# EAGLE schematic cryotest-kintex7 (EAGLE 7.4.0)

## Sheet 1 of 15: JTAG
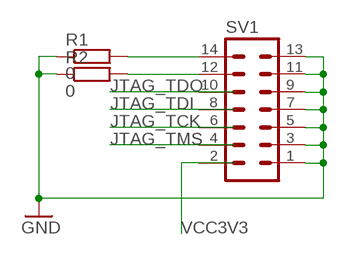
[diagram p0: schematic, sheet 1]

### Parts
R1  0  R-EU_R0805  [R0805]
R2  0  R-EU_R0805  [R0805]
SV1  MA07-2  [MA07-2]

### Nets
12_SV1: R2.2 SV1.12
14_SV1: R1.2 SV1.14
GND: R1.1 R2.1 SV1.1 SV1.3 SV1.5 SV1.7 SV1.9 SV1.11 SV1.13 ; also sheet 2,7,9,10,11,12,13,14,15
Unconnected: SV1.2 SV1.4 SV1.6 SV1.8 SV1.10

## Sheet 2 of 15: FPGA Bank 0
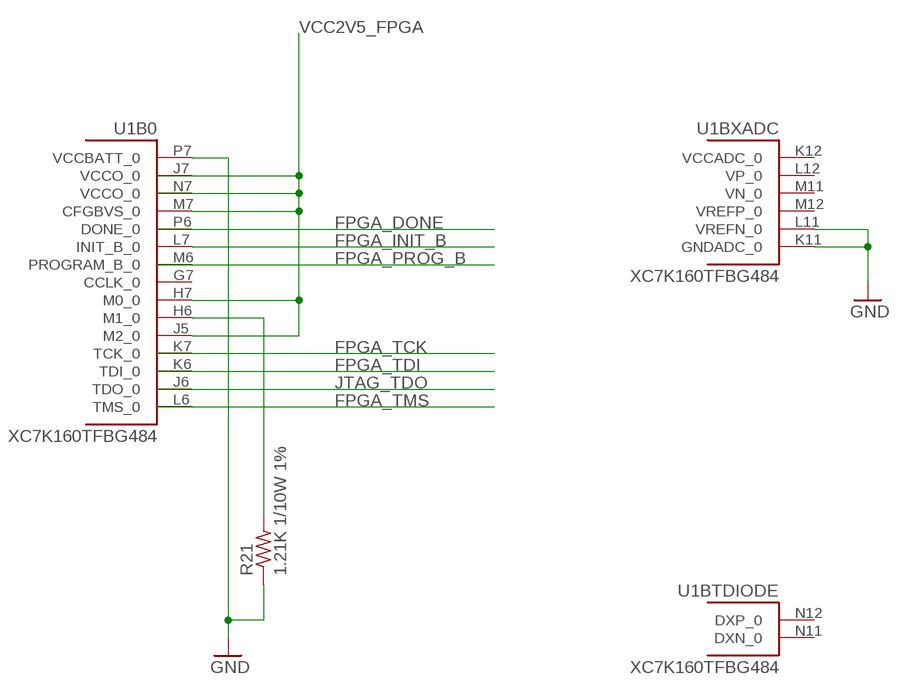
[diagram p1: schematic, sheet 2]

### Parts
R21  1.21K 1/10W 1%  R-US_R0402  [R0402]
U1  XC7K160TFBG484  [FF484]

### Nets
FPGA_INIT_B: U1.L7(B0:INIT_B_0) ; also sheet 7
FPGA_M1: R21.2 U1.H6(B0:M1_0)
GND: R21.1 U1.K11(BXADC:GNDADC_0) U1.L11(BXADC:VREFN_0) U1.P7(B0:VCCBATT_0) ; also sheet 1,7,9,10,11,12,13,14,15
VCC2V5_FPGA: U1.H7(B0:M0_0) U1.J5(B0:M2_0) U1.M7(B0:CFGBVS_0) ; also sheet 3,4,7,10,13,14
Unconnected: U1.G7(B0:CCLK_0) U1.J6(B0:TDO_0) U1.J7(B0:VCCO_0) U1.K6(B0:TDI_0) U1.K7(B0:TCK_0) U1.K12(BXADC:VCCADC_0) U1.L6(B0:TMS_0) U1.L12(BXADC:VP_0) U1.M6(B0:PROGRAM_B_0) U1.M11(BXADC:VN_0) U1.M12(BXADC:VREFP_0) U1.N7(B0:VCCO_0) U1.N11(BTDIODE:DXN_0) U1.N12(BTDIODE:DXP_0) U1.P6(B0:DONE_0)

## Sheet 3 of 15: FPGA Banks 13, 14
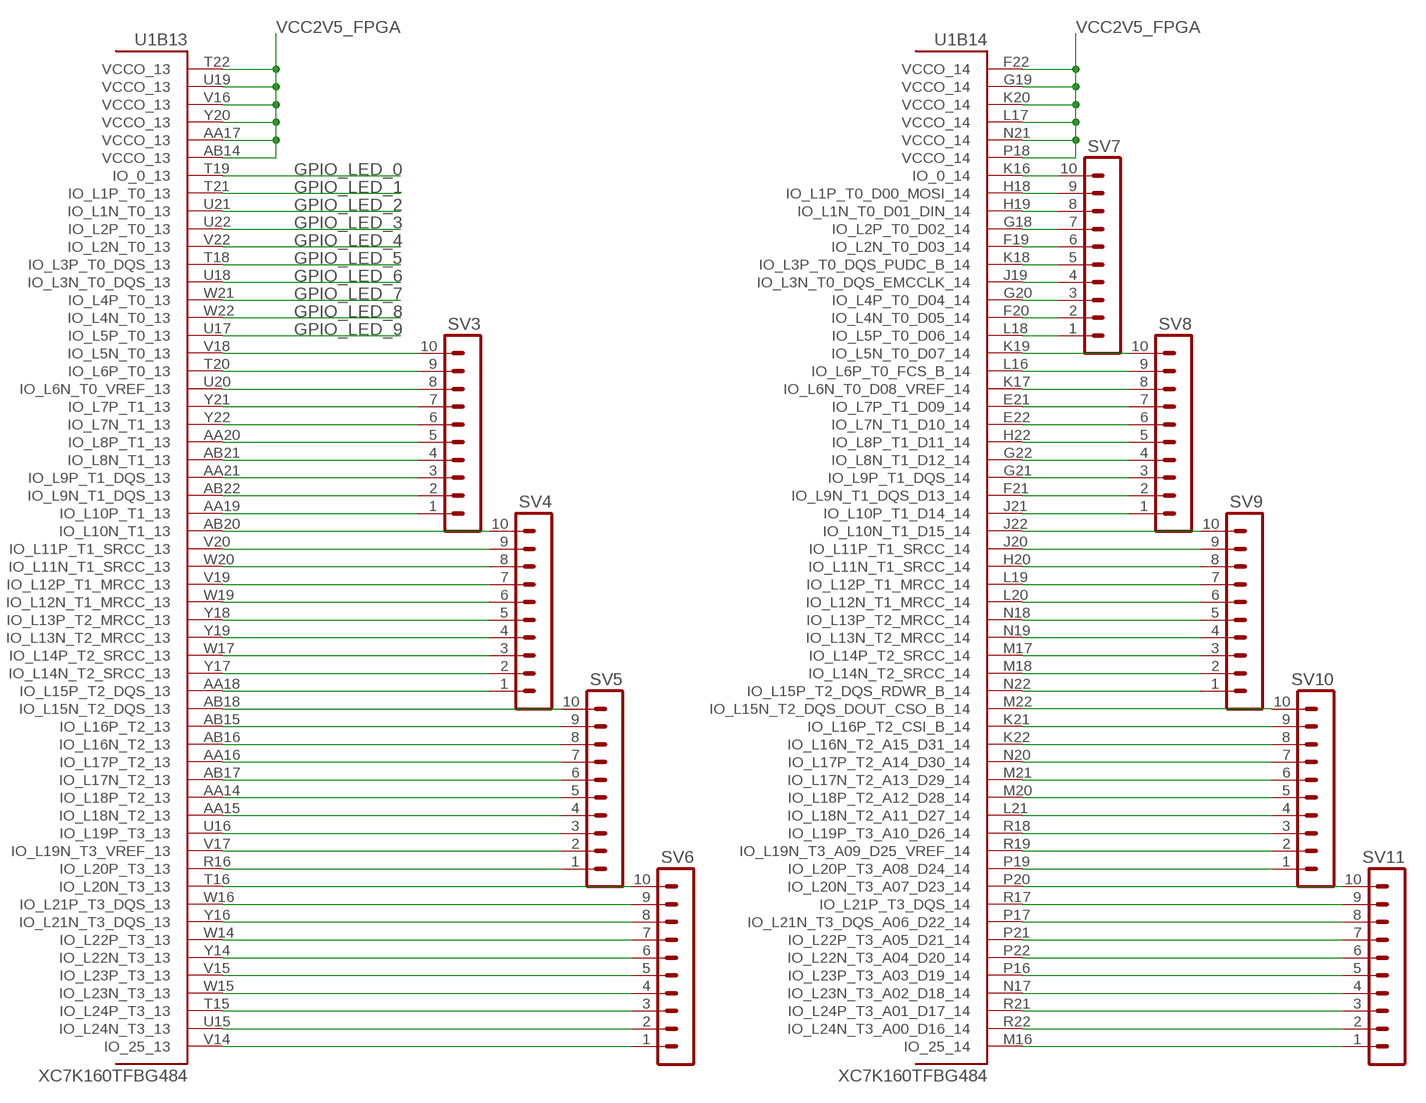
[diagram p2: schematic, sheet 3]

### Parts
SV3  MA10-1  [MA10-1]
SV4  MA10-1  [MA10-1]
SV5  MA10-1  [MA10-1]
SV6  MA10-1  [MA10-1]
SV7  MA10-1  [MA10-1]
SV8  MA10-1  [MA10-1]
SV9  MA10-1  [MA10-1]
SV10  MA10-1  [MA10-1]
SV11  MA10-1  [MA10-1]

### Nets
GPIO_LED_0: U1.T19(B13:IO_0_13) ; also sheet 7
GPIO_LED_1: U1.T21(B13:IO_L1P_T0_13) ; also sheet 7
GPIO_LED_2: U1.U21(B13:IO_L1N_T0_13) ; also sheet 7
GPIO_LED_3: U1.U22(B13:IO_L2P_T0_13) ; also sheet 7
GPIO_LED_4: U1.V22(B13:IO_L2N_T0_13) ; also sheet 7
GPIO_LED_5: U1.T18(B13:IO_L3P_T0_DQS_13) ; also sheet 7
GPIO_LED_6: U1.U18(B13:IO_L3N_T0_DQS_13) ; also sheet 7
GPIO_LED_7: U1.W21(B13:IO_L4P_T0_13) ; also sheet 7
GPIO_LED_8: U1.W22(B13:IO_L4N_T0_13) ; also sheet 7
GPIO_LED_9: U1.U17(B13:IO_L5P_T0_13) ; also sheet 7
N$14: SV3.10 U1.V18(B13:IO_L5N_T0_13)
N$15: SV3.9 U1.T20(B13:IO_L6P_T0_13)
N$16: SV3.8 U1.U20(B13:IO_L6N_T0_VREF_13)
N$17: SV3.7 U1.Y21(B13:IO_L7P_T1_13)
N$19: SV3.6 U1.Y22(B13:IO_L7N_T1_13)
N$20: SV3.5 U1.AA20(B13:IO_L8P_T1_13)
N$21: SV3.4 U1.AB21(B13:IO_L8N_T1_13)
N$22: SV3.3 U1.AA21(B13:IO_L9P_T1_DQS_13)
N$23: SV3.2 U1.AB22(B13:IO_L9N_T1_DQS_13)
N$24: SV3.1 U1.AA19(B13:IO_L10P_T1_13)
N$25: SV4.10 U1.AB20(B13:IO_L10N_T1_13)
N$26: SV4.9 U1.V20(B13:IO_L11P_T1_SRCC_13)
N$27: SV4.8 U1.W20(B13:IO_L11N_T1_SRCC_13)
N$28: SV4.7 U1.V19(B13:IO_L12P_T1_MRCC_13)
N$29: SV4.6 U1.W19(B13:IO_L12N_T1_MRCC_13)
N$30: SV4.5 U1.Y18(B13:IO_L13P_T2_MRCC_13)
N$31: SV4.4 U1.Y19(B13:IO_L13N_T2_MRCC_13)
N$32: SV4.3 U1.W17(B13:IO_L14P_T2_SRCC_13)
N$33: SV4.2 U1.Y17(B13:IO_L14N_T2_SRCC_13)
N$34: SV4.1 U1.AA18(B13:IO_L15P_T2_DQS_13)
N$35: SV5.10 U1.AB18(B13:IO_L15N_T2_DQS_13)
N$36: SV5.9 U1.AB15(B13:IO_L16P_T2_13)
N$37: SV5.8 U1.AB16(B13:IO_L16N_T2_13)
N$38: SV5.7 U1.AA16(B13:IO_L17P_T2_13)
N$39: SV5.6 U1.AB17(B13:IO_L17N_T2_13)
N$40: SV5.5 U1.AA14(B13:IO_L18P_T2_13)
N$41: SV5.4 U1.AA15(B13:IO_L18N_T2_13)
N$42: SV5.3 U1.U16(B13:IO_L19P_T3_13)
N$43: SV5.2 U1.V17(B13:IO_L19N_T3_VREF_13)
N$44: SV5.1 U1.R16(B13:IO_L20P_T3_13)
N$45: SV6.10 U1.T16(B13:IO_L20N_T3_13)
N$46: SV6.9 U1.W16(B13:IO_L21P_T3_DQS_13)
N$47: SV6.8 U1.Y16(B13:IO_L21N_T3_DQS_13)
N$48: SV6.7 U1.W14(B13:IO_L22P_T3_13)
N$49: SV6.6 U1.Y14(B13:IO_L22N_T3_13)
N$50: SV6.5 U1.V15(B13:IO_L23P_T3_13)
N$51: SV6.4 U1.W15(B13:IO_L23N_T3_13)
N$52: SV6.3 U1.T15(B13:IO_L24P_T3_13)
N$53: SV6.2 U1.U15(B13:IO_L24N_T3_13)
N$54: SV6.1 U1.V14(B13:IO_25_13)
N$55: SV7.10 U1.K16(B14:IO_0_14)
N$56: SV7.9 U1.H18(B14:IO_L1P_T0_D00_MOSI_14)
N$57: SV7.8 U1.H19(B14:IO_L1N_T0_D01_DIN_14)
N$58: SV7.7 U1.G18(B14:IO_L2P_T0_D02_14)
N$59: SV7.6 U1.F19(B14:IO_L2N_T0_D03_14)
N$60: SV7.5 U1.K18(B14:IO_L3P_T0_DQS_PUDC_B_14)
N$61: SV7.4 U1.J19(B14:IO_L3N_T0_DQS_EMCCLK_14)
N$62: SV7.3 U1.G20(B14:IO_L4P_T0_D04_14)
N$63: SV7.2 U1.F20(B14:IO_L4N_T0_D05_14)
N$64: SV7.1 U1.L18(B14:IO_L5P_T0_D06_14)
N$65: SV8.10 U1.K19(B14:IO_L5N_T0_D07_14)
N$66: SV8.9 U1.L16(B14:IO_L6P_T0_FCS_B_14)
N$67: SV8.8 U1.K17(B14:IO_L6N_T0_D08_VREF_14)
N$68: SV8.7 U1.E21(B14:IO_L7P_T1_D09_14)
N$69: SV8.6 U1.E22(B14:IO_L7N_T1_D10_14)
N$70: SV8.5 U1.H22(B14:IO_L8P_T1_D11_14)
N$71: SV8.4 U1.G22(B14:IO_L8N_T1_D12_14)
N$72: SV8.3 U1.G21(B14:IO_L9P_T1_DQS_14)
N$73: SV8.2 U1.F21(B14:IO_L9N_T1_DQS_D13_14)
N$74: SV8.1 U1.J21(B14:IO_L10P_T1_D14_14)
N$75: SV9.10 U1.J22(B14:IO_L10N_T1_D15_14)
N$76: SV9.9 U1.J20(B14:IO_L11P_T1_SRCC_14)
N$77: SV9.8 U1.H20(B14:IO_L11N_T1_SRCC_14)
N$78: SV9.7 U1.L19(B14:IO_L12P_T1_MRCC_14)
N$79: SV9.6 U1.L20(B14:IO_L12N_T1_MRCC_14)
N$80: SV9.5 U1.N18(B14:IO_L13P_T2_MRCC_14)
N$81: SV9.4 U1.N19(B14:IO_L13N_T2_MRCC_14)
N$82: SV9.3 U1.M17(B14:IO_L14P_T2_SRCC_14)
N$83: SV9.2 U1.M18(B14:IO_L14N_T2_SRCC_14)
N$84: SV9.1 U1.N22(B14:IO_L15P_T2_DQS_RDWR_B_14)
N$85: SV10.10 U1.M22(B14:IO_L15N_T2_DQS_DOUT_CSO_B_14)
N$86: SV10.9 U1.K21(B14:IO_L16P_T2_CSI_B_14)
N$87: SV10.8 U1.K22(B14:IO_L16N_T2_A15_D31_14)
N$88: SV10.7 U1.N20(B14:IO_L17P_T2_A14_D30_14)
N$89: SV10.6 U1.M21(B14:IO_L17N_T2_A13_D29_14)
N$90: SV10.5 U1.M20(B14:IO_L18P_T2_A12_D28_14)
N$91: SV10.4 U1.L21(B14:IO_L18N_T2_A11_D27_14)
N$92: SV10.3 U1.R18(B14:IO_L19P_T3_A10_D26_14)
N$93: SV10.2 U1.R19(B14:IO_L19N_T3_A09_D25_VREF_14)
N$94: SV10.1 U1.P19(B14:IO_L20P_T3_A08_D24_14)
N$95: SV11.10 U1.P20(B14:IO_L20N_T3_A07_D23_14)
N$96: SV11.9 U1.R17(B14:IO_L21P_T3_DQS_14)
N$97: SV11.8 U1.P17(B14:IO_L21N_T3_DQS_A06_D22_14)
N$98: SV11.7 U1.P21(B14:IO_L22P_T3_A05_D21_14)
N$99: SV11.6 U1.P22(B14:IO_L22N_T3_A04_D20_14)
N$100: SV11.5 U1.P16(B14:IO_L23P_T3_A03_D19_14)
N$101: SV11.4 U1.N17(B14:IO_L23N_T3_A02_D18_14)
N$102: SV11.3 U1.R21(B14:IO_L24P_T3_A01_D17_14)
N$103: SV11.2 U1.R22(B14:IO_L24N_T3_A00_D16_14)
N$104: SV11.1 U1.M16(B14:IO_25_14)
VCC2V5_FPGA: U1.AA17(B13:VCCO_13) U1.AB14(B13:VCCO_13) U1.F22(B14:VCCO_14) U1.G19(B14:VCCO_14) U1.K20(B14:VCCO_14) U1.L17(B14:VCCO_14) U1.N21(B14:VCCO_14) U1.P18(B14:VCCO_14) U1.T22(B13:VCCO_13) U1.U19(B13:VCCO_13) U1.V16(B13:VCCO_13) U1.Y20(B13:VCCO_13) ; also sheet 2,4,7,10,13,14

## Sheet 4 of 15: FPGA Banks 15, 16
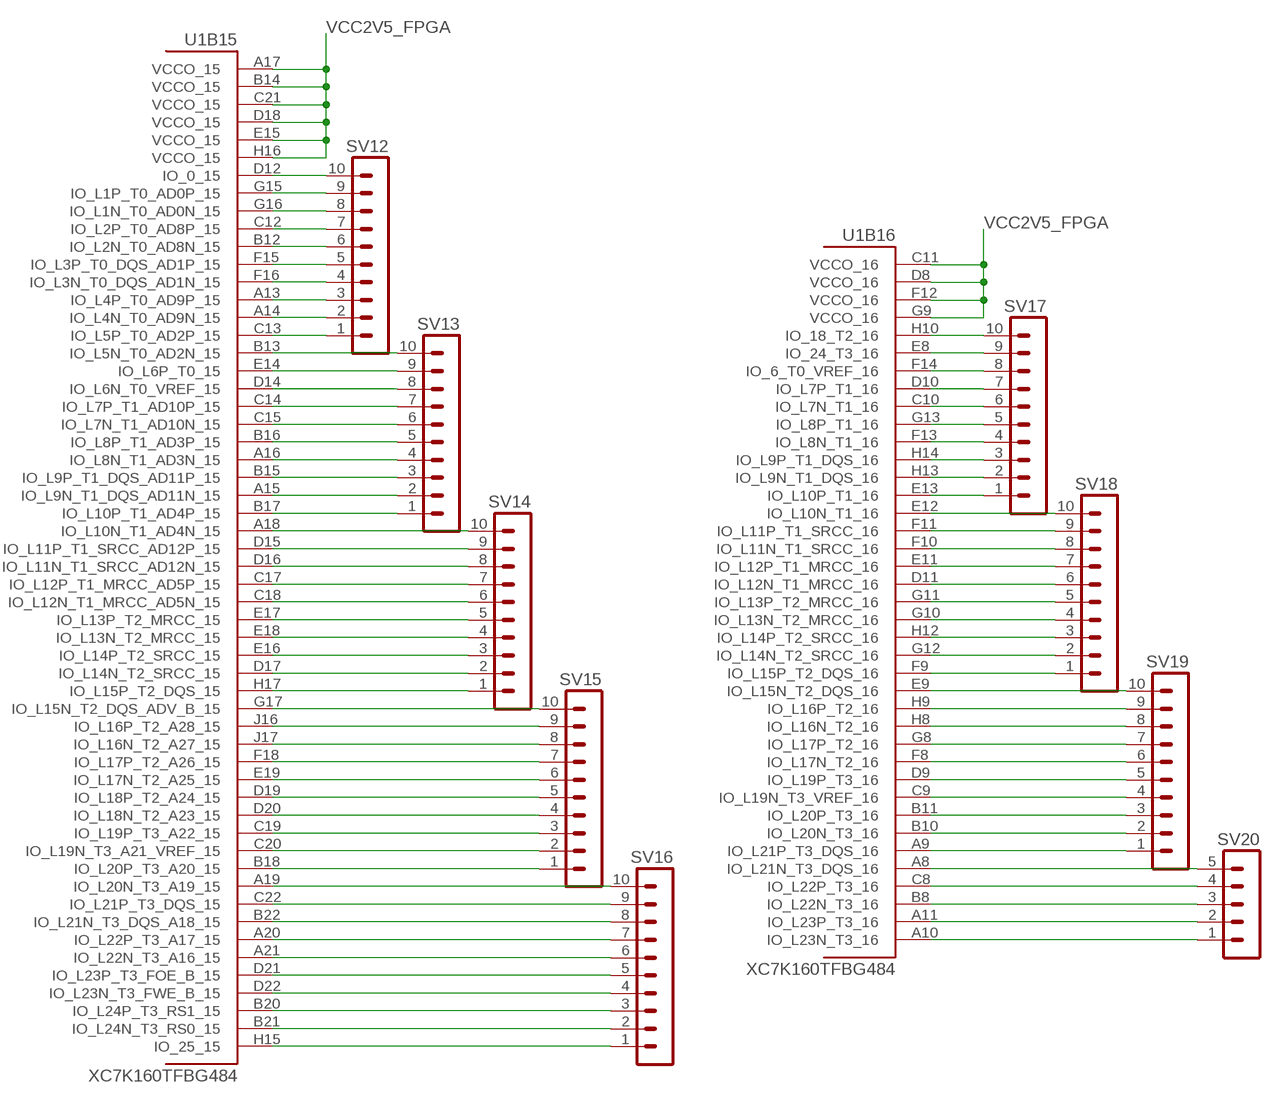
[diagram p3: schematic, sheet 4]

### Parts
SV12  MA10-1  [MA10-1]
SV13  MA10-1  [MA10-1]
SV14  MA10-1  [MA10-1]
SV15  MA10-1  [MA10-1]
SV16  MA10-1  [MA10-1]
SV17  MA10-1  [MA10-1]
SV18  MA10-1  [MA10-1]
SV19  MA10-1  [MA10-1]
SV20  MA05-1  [MA05-1]

### Nets
N$105: SV12.1 U1.C13(B15:IO_L5P_T0_AD2P_15)
N$106: SV12.2 U1.A14(B15:IO_L4N_T0_AD9N_15)
N$107: SV12.3 U1.A13(B15:IO_L4P_T0_AD9P_15)
N$108: SV12.4 U1.F16(B15:IO_L3N_T0_DQS_AD1N_15)
N$109: SV12.5 U1.F15(B15:IO_L3P_T0_DQS_AD1P_15)
N$110: SV12.6 U1.B12(B15:IO_L2N_T0_AD8N_15)
N$111: SV12.7 U1.C12(B15:IO_L2P_T0_AD8P_15)
N$112: SV12.8 U1.G16(B15:IO_L1N_T0_AD0N_15)
N$113: SV12.9 U1.G15(B15:IO_L1P_T0_AD0P_15)
N$114: SV12.10 U1.D12(B15:IO_0_15)
N$115: SV13.1 U1.B17(B15:IO_L10P_T1_AD4P_15)
N$116: SV13.2 U1.A15(B15:IO_L9N_T1_DQS_AD11N_15)
N$117: SV13.3 U1.B15(B15:IO_L9P_T1_DQS_AD11P_15)
N$118: SV13.4 U1.A16(B15:IO_L8N_T1_AD3N_15)
N$119: SV13.5 U1.B16(B15:IO_L8P_T1_AD3P_15)
N$120: SV13.6 U1.C15(B15:IO_L7N_T1_AD10N_15)
N$121: SV13.7 U1.C14(B15:IO_L7P_T1_AD10P_15)
N$122: SV13.8 U1.D14(B15:IO_L6N_T0_VREF_15)
N$123: SV13.9 U1.E14(B15:IO_L6P_T0_15)
N$124: SV13.10 U1.B13(B15:IO_L5N_T0_AD2N_15)
N$125: SV14.1 U1.H17(B15:IO_L15P_T2_DQS_15)
N$126: SV14.2 U1.D17(B15:IO_L14N_T2_SRCC_15)
N$127: SV14.3 U1.E16(B15:IO_L14P_T2_SRCC_15)
N$128: SV14.4 U1.E18(B15:IO_L13N_T2_MRCC_15)
N$129: SV14.5 U1.E17(B15:IO_L13P_T2_MRCC_15)
N$130: SV14.6 U1.C18(B15:IO_L12N_T1_MRCC_AD5N_15)
N$131: SV14.7 U1.C17(B15:IO_L12P_T1_MRCC_AD5P_15)
N$132: SV14.8 U1.D16(B15:IO_L11N_T1_SRCC_AD12N_15)
N$133: SV14.9 U1.D15(B15:IO_L11P_T1_SRCC_AD12P_15)
N$134: SV14.10 U1.A18(B15:IO_L10N_T1_AD4N_15)
N$135: SV15.1 U1.B18(B15:IO_L20P_T3_A20_15)
N$136: SV15.2 U1.C20(B15:IO_L19N_T3_A21_VREF_15)
N$137: SV15.3 U1.C19(B15:IO_L19P_T3_A22_15)
N$138: SV15.4 U1.D20(B15:IO_L18N_T2_A23_15)
N$139: SV15.5 U1.D19(B15:IO_L18P_T2_A24_15)
N$140: SV15.6 U1.E19(B15:IO_L17N_T2_A25_15)
N$141: SV15.7 U1.F18(B15:IO_L17P_T2_A26_15)
N$142: SV15.8 U1.J17(B15:IO_L16N_T2_A27_15)
N$143: SV15.9 U1.J16(B15:IO_L16P_T2_A28_15)
N$144: SV15.10 U1.G17(B15:IO_L15N_T2_DQS_ADV_B_15)
N$145: SV16.1 U1.H15(B15:IO_25_15)
N$146: SV16.2 U1.B21(B15:IO_L24N_T3_RS0_15)
N$147: SV16.3 U1.B20(B15:IO_L24P_T3_RS1_15)
N$148: SV16.4 U1.D22(B15:IO_L23N_T3_FWE_B_15)
N$149: SV16.5 U1.D21(B15:IO_L23P_T3_FOE_B_15)
N$150: SV16.6 U1.A21(B15:IO_L22N_T3_A16_15)
N$151: SV16.7 U1.A20(B15:IO_L22P_T3_A17_15)
N$152: SV16.8 U1.B22(B15:IO_L21N_T3_DQS_A18_15)
N$153: SV16.9 U1.C22(B15:IO_L21P_T3_DQS_15)
N$154: SV16.10 U1.A19(B15:IO_L20N_T3_A19_15)
N$155: SV17.1 U1.E13(B16:IO_L10P_T1_16)
N$156: SV17.2 U1.H13(B16:IO_L9N_T1_DQS_16)
N$157: SV17.3 U1.H14(B16:IO_L9P_T1_DQS_16)
N$158: SV17.4 U1.F13(B16:IO_L8N_T1_16)
N$159: SV17.5 U1.G13(B16:IO_L8P_T1_16)
N$160: SV17.6 U1.C10(B16:IO_L7N_T1_16)
N$161: SV17.7 U1.D10(B16:IO_L7P_T1_16)
N$162: SV17.8 U1.F14(B16:IO_6_T0_VREF_16)
N$163: SV17.9 U1.E8(B16:IO_24_T3_16)
N$164: SV17.10 U1.H10(B16:IO_18_T2_16)
N$165: SV18.1 U1.F9(B16:IO_L15P_T2_DQS_16)
N$166: SV18.2 U1.G12(B16:IO_L14N_T2_SRCC_16)
N$167: SV18.3 U1.H12(B16:IO_L14P_T2_SRCC_16)
N$168: SV18.4 U1.G10(B16:IO_L13N_T2_MRCC_16)
N$169: SV18.5 U1.G11(B16:IO_L13P_T2_MRCC_16)
N$170: SV18.6 U1.D11(B16:IO_L12N_T1_MRCC_16)
N$171: SV18.7 U1.E11(B16:IO_L12P_T1_MRCC_16)
N$172: SV18.8 U1.F10(B16:IO_L11N_T1_SRCC_16)
N$173: SV18.9 U1.F11(B16:IO_L11P_T1_SRCC_16)
N$174: SV18.10 U1.E12(B16:IO_L10N_T1_16)
N$175: SV19.1 U1.A9(B16:IO_L21P_T3_DQS_16)
N$176: SV19.2 U1.B10(B16:IO_L20N_T3_16)
N$177: SV19.3 U1.B11(B16:IO_L20P_T3_16)
N$178: SV19.4 U1.C9(B16:IO_L19N_T3_VREF_16)
N$179: SV19.5 U1.D9(B16:IO_L19P_T3_16)
N$180: SV19.6 U1.F8(B16:IO_L17N_T2_16)
N$181: SV19.7 U1.G8(B16:IO_L17P_T2_16)
N$182: SV19.8 U1.H8(B16:IO_L16N_T2_16)
N$183: SV19.9 U1.H9(B16:IO_L16P_T2_16)
N$184: SV19.10 U1.E9(B16:IO_L15N_T2_DQS_16)
N$185: SV20.1 U1.A10(B16:IO_L23N_T3_16)
N$186: SV20.2 U1.A11(B16:IO_L23P_T3_16)
N$187: SV20.3 U1.B8(B16:IO_L22N_T3_16)
N$188: SV20.4 U1.C8(B16:IO_L22P_T3_16)
N$189: SV20.5 U1.A8(B16:IO_L21N_T3_DQS_16)
VCC2V5_FPGA: U1.A17(B15:VCCO_15) U1.B14(B15:VCCO_15) U1.C11(B16:VCCO_16) U1.C21(B15:VCCO_15) U1.D8(B16:VCCO_16) U1.D18(B15:VCCO_15) U1.E15(B15:VCCO_15) U1.F12(B16:VCCO_16) U1.G9(B16:VCCO_16) U1.H16(B15:VCCO_15) ; also sheet 2,3,7,10,13,14

## Sheet 5 of 15: FPGA Banks 33, 34
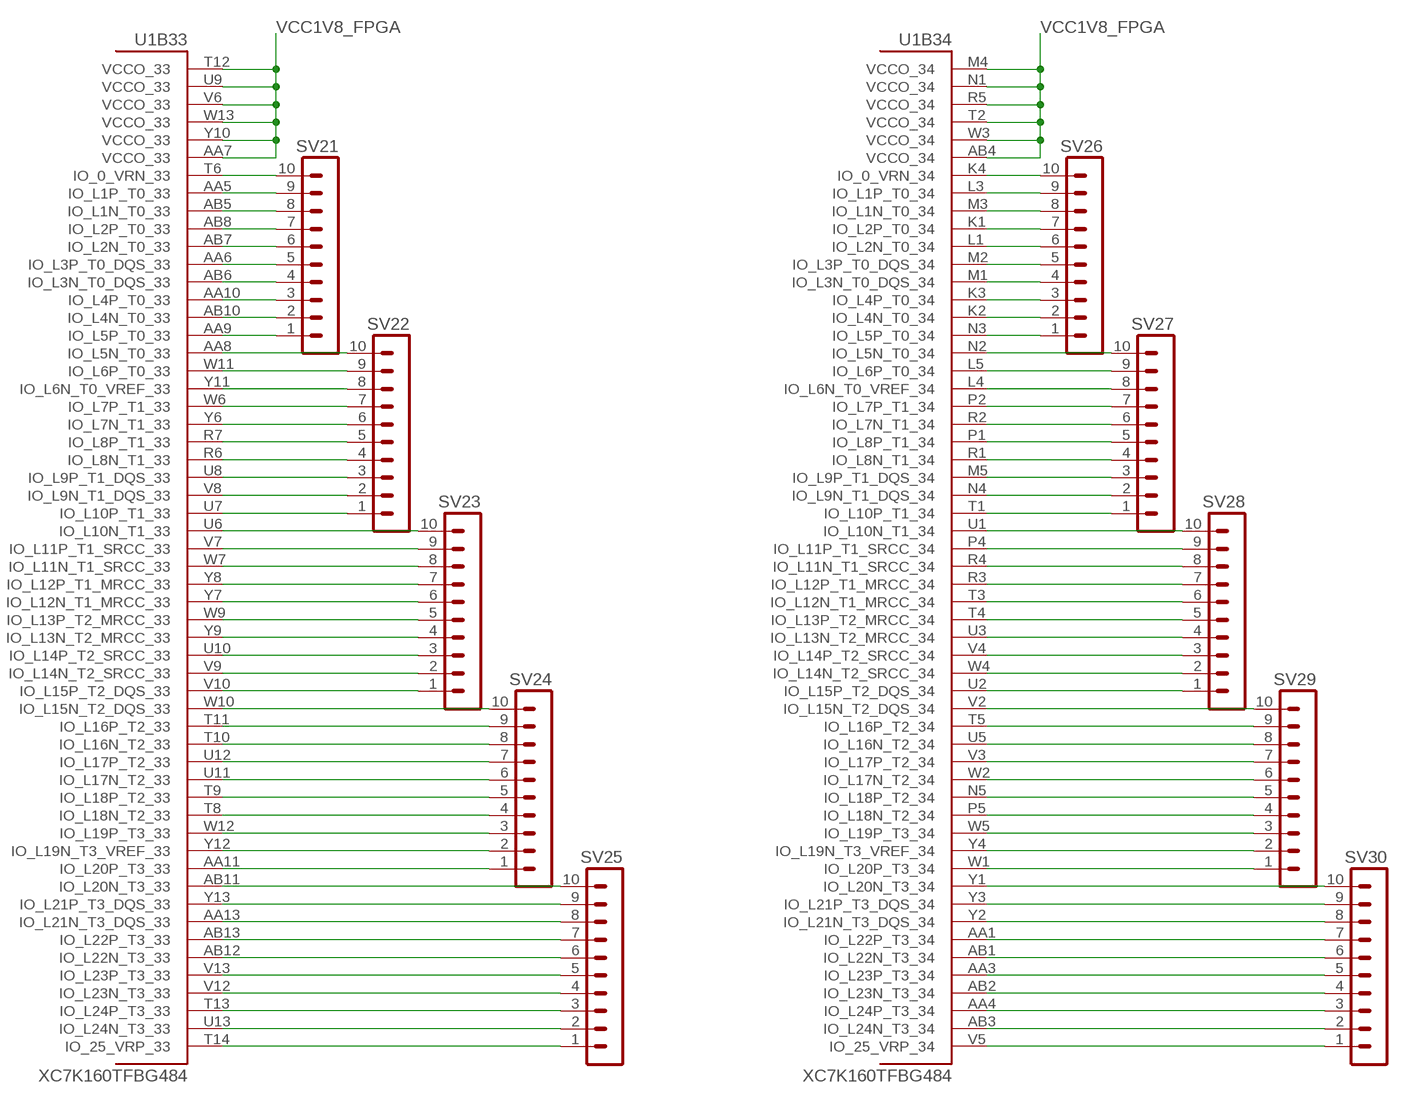
[diagram p4: schematic, sheet 5]

### Parts
SV21  MA10-1  [MA10-1]
SV22  MA10-1  [MA10-1]
SV23  MA10-1  [MA10-1]
SV24  MA10-1  [MA10-1]
SV25  MA10-1  [MA10-1]
SV26  MA10-1  [MA10-1]
SV27  MA10-1  [MA10-1]
SV28  MA10-1  [MA10-1]
SV29  MA10-1  [MA10-1]
SV30  MA10-1  [MA10-1]

### Nets
N$190: SV21.1 U1.AA9(B33:IO_L5P_T0_33)
N$191: SV21.2 U1.AB10(B33:IO_L4N_T0_33)
N$192: SV21.3 U1.AA10(B33:IO_L4P_T0_33)
N$193: SV21.4 U1.AB6(B33:IO_L3N_T0_DQS_33)
N$194: SV21.5 U1.AA6(B33:IO_L3P_T0_DQS_33)
N$195: SV21.6 U1.AB7(B33:IO_L2N_T0_33)
N$196: SV21.7 U1.AB8(B33:IO_L2P_T0_33)
N$197: SV21.8 U1.AB5(B33:IO_L1N_T0_33)
N$198: SV21.9 U1.AA5(B33:IO_L1P_T0_33)
N$199: SV21.10 U1.T6(B33:IO_0_VRN_33)
N$200: SV22.1 U1.U7(B33:IO_L10P_T1_33)
N$201: SV22.2 U1.V8(B33:IO_L9N_T1_DQS_33)
N$202: SV22.3 U1.U8(B33:IO_L9P_T1_DQS_33)
N$203: SV22.4 U1.R6(B33:IO_L8N_T1_33)
N$204: SV22.5 U1.R7(B33:IO_L8P_T1_33)
N$205: SV22.6 U1.Y6(B33:IO_L7N_T1_33)
N$206: SV22.7 U1.W6(B33:IO_L7P_T1_33)
N$207: SV22.8 U1.Y11(B33:IO_L6N_T0_VREF_33)
N$208: SV22.9 U1.W11(B33:IO_L6P_T0_33)
N$209: SV22.10 U1.AA8(B33:IO_L5N_T0_33)
N$210: SV23.1 U1.V10(B33:IO_L15P_T2_DQS_33)
N$211: SV23.2 U1.V9(B33:IO_L14N_T2_SRCC_33)
N$212: SV23.3 U1.U10(B33:IO_L14P_T2_SRCC_33)
N$213: SV23.4 U1.Y9(B33:IO_L13N_T2_MRCC_33)
N$214: SV23.5 U1.W9(B33:IO_L13P_T2_MRCC_33)
N$215: SV23.6 U1.Y7(B33:IO_L12N_T1_MRCC_33)
N$216: SV23.7 U1.Y8(B33:IO_L12P_T1_MRCC_33)
N$217: SV23.8 U1.W7(B33:IO_L11N_T1_SRCC_33)
N$218: SV23.9 U1.V7(B33:IO_L11P_T1_SRCC_33)
N$219: SV23.10 U1.U6(B33:IO_L10N_T1_33)
N$220: SV24.1 U1.AA11(B33:IO_L20P_T3_33)
N$221: SV24.2 U1.Y12(B33:IO_L19N_T3_VREF_33)
N$222: SV24.3 U1.W12(B33:IO_L19P_T3_33)
N$223: SV24.4 U1.T8(B33:IO_L18N_T2_33)
N$224: SV24.5 U1.T9(B33:IO_L18P_T2_33)
N$225: SV24.6 U1.U11(B33:IO_L17N_T2_33)
N$226: SV24.7 U1.U12(B33:IO_L17P_T2_33)
N$227: SV24.8 U1.T10(B33:IO_L16N_T2_33)
N$228: SV24.9 U1.T11(B33:IO_L16P_T2_33)
N$229: SV24.10 U1.W10(B33:IO_L15N_T2_DQS_33)
N$230: SV25.1 U1.T14(B33:IO_25_VRP_33)
N$231: SV25.2 U1.U13(B33:IO_L24N_T3_33)
N$232: SV25.3 U1.T13(B33:IO_L24P_T3_33)
N$233: SV25.4 U1.V12(B33:IO_L23N_T3_33)
N$234: SV25.5 U1.V13(B33:IO_L23P_T3_33)
N$235: SV25.6 U1.AB12(B33:IO_L22N_T3_33)
N$236: SV25.7 U1.AB13(B33:IO_L22P_T3_33)
N$237: SV25.8 U1.AA13(B33:IO_L21N_T3_DQS_33)
N$238: SV25.9 U1.Y13(B33:IO_L21P_T3_DQS_33)
N$239: SV25.10 U1.AB11(B33:IO_L20N_T3_33)
N$240: SV26.1 U1.N3(B34:IO_L5P_T0_34)
N$241: SV26.2 U1.K2(B34:IO_L4N_T0_34)
N$242: SV26.3 U1.K3(B34:IO_L4P_T0_34)
N$243: SV26.4 U1.M1(B34:IO_L3N_T0_DQS_34)
N$244: SV26.5 U1.M2(B34:IO_L3P_T0_DQS_34)
N$245: SV26.6 U1.L1(B34:IO_L2N_T0_34)
N$246: SV26.7 U1.K1(B34:IO_L2P_T0_34)
N$247: SV26.8 U1.M3(B34:IO_L1N_T0_34)
N$248: SV26.9 U1.L3(B34:IO_L1P_T0_34)
N$249: SV26.10 U1.K4(B34:IO_0_VRN_34)
N$250: SV27.1 U1.T1(B34:IO_L10P_T1_34)
N$251: SV27.2 U1.N4(B34:IO_L9N_T1_DQS_34)
N$252: SV27.3 U1.M5(B34:IO_L9P_T1_DQS_34)
N$253: SV27.4 U1.R1(B34:IO_L8N_T1_34)
N$254: SV27.5 U1.P1(B34:IO_L8P_T1_34)
N$255: SV27.6 U1.R2(B34:IO_L7N_T1_34)
N$256: SV27.7 U1.P2(B34:IO_L7P_T1_34)
N$257: SV27.8 U1.L4(B34:IO_L6N_T0_VREF_34)
N$258: SV27.9 U1.L5(B34:IO_L6P_T0_34)
N$259: SV27.10 U1.N2(B34:IO_L5N_T0_34)
N$260: SV28.1 U1.U2(B34:IO_L15P_T2_DQS_34)
N$261: SV28.2 U1.W4(B34:IO_L14N_T2_SRCC_34)
N$262: SV28.3 U1.V4(B34:IO_L14P_T2_SRCC_34)
N$263: SV28.4 U1.U3(B34:IO_L13N_T2_MRCC_34)
N$264: SV28.5 U1.T4(B34:IO_L13P_T2_MRCC_34)
N$265: SV28.6 U1.T3(B34:IO_L12N_T1_MRCC_34)
N$266: SV28.7 U1.R3(B34:IO_L12P_T1_MRCC_34)
N$267: SV28.8 U1.R4(B34:IO_L11N_T1_SRCC_34)
N$268: SV28.9 U1.P4(B34:IO_L11P_T1_SRCC_34)
N$269: SV28.10 U1.U1(B34:IO_L10N_T1_34)
N$270: SV29.1 U1.W1(B34:IO_L20P_T3_34)
N$271: SV29.2 U1.Y4(B34:IO_L19N_T3_VREF_34)
N$272: SV29.3 U1.W5(B34:IO_L19P_T3_34)
N$273: SV29.4 U1.P5(B34:IO_L18N_T2_34)
N$274: SV29.5 U1.N5(B34:IO_L18P_T2_34)
N$275: SV29.6 U1.W2(B34:IO_L17N_T2_34)
N$276: SV29.7 U1.V3(B34:IO_L17P_T2_34)
N$277: SV29.8 U1.U5(B34:IO_L16N_T2_34)
N$278: SV29.9 U1.T5(B34:IO_L16P_T2_34)
N$279: SV29.10 U1.V2(B34:IO_L15N_T2_DQS_34)
N$280: SV30.1 U1.V5(B34:IO_25_VRP_34)
N$281: SV30.2 U1.AB3(B34:IO_L24N_T3_34)
N$282: SV30.3 U1.AA4(B34:IO_L24P_T3_34)
N$283: SV30.4 U1.AB2(B34:IO_L23N_T3_34)
N$284: SV30.5 U1.AA3(B34:IO_L23P_T3_34)
N$285: SV30.6 U1.AB1(B34:IO_L22N_T3_34)
N$286: SV30.7 U1.AA1(B34:IO_L22P_T3_34)
N$287: SV30.8 U1.Y2(B34:IO_L21N_T3_DQS_34)
N$288: SV30.9 U1.Y3(B34:IO_L21P_T3_DQS_34)
N$289: SV30.10 U1.Y1(B34:IO_L20N_T3_34)
VCC1V8_FPGA: U1.AA7(B33:VCCO_33) U1.AB4(B34:VCCO_34) U1.M4(B34:VCCO_34) U1.N1(B34:VCCO_34) U1.R5(B34:VCCO_34) U1.T2(B34:VCCO_34) U1.T12(B33:VCCO_33) U1.U9(B33:VCCO_33) U1.V6(B33:VCCO_33) U1.W3(B34:VCCO_34) U1.W13(B33:VCCO_33) U1.Y10(B33:VCCO_33) ; also sheet 10,13

## Sheet 6 of 15: MGT Quad 115
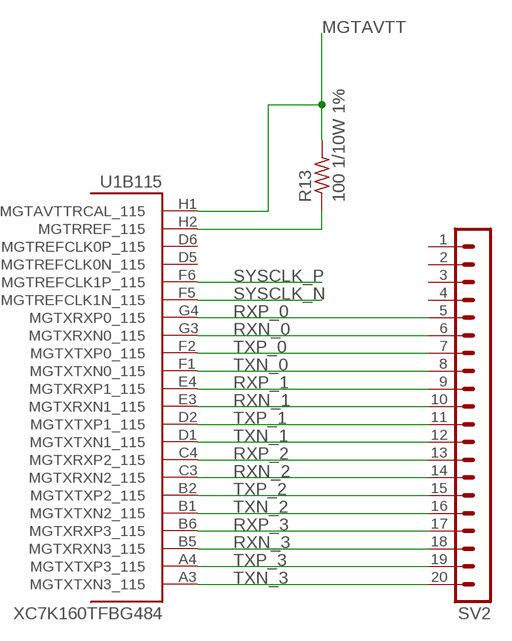
[diagram p5: schematic, sheet 6]

### Parts
R13  100 1/10W 1%  R-US_R0402  [R0402]
SV2  MA20-1  [MA20-1]

### Nets
H2: R13.1 U1.H2(B115:MGTRREF_115)
MGTAVTT: R13.2 U1.H1(B115:MGTAVTTRCAL_115) ; also sheet 8,11
RXN_0: SV2.6 U1.G3(B115:MGTXRXN0_115)
RXN_1: SV2.10 U1.E3(B115:MGTXRXN1_115)
RXN_2: SV2.14 U1.C3(B115:MGTXRXN2_115)
RXN_3: SV2.18 U1.B5(B115:MGTXRXN3_115)
RXP_0: SV2.5 U1.G4(B115:MGTXRXP0_115)
RXP_1: SV2.9 U1.E4(B115:MGTXRXP1_115)
RXP_2: SV2.13 U1.C4(B115:MGTXRXP2_115)
RXP_3: SV2.17 U1.B6(B115:MGTXRXP3_115)
SYSCLK_N: U1.F5(B115:MGTREFCLK1N_115) ; also sheet 14
SYSCLK_P: U1.F6(B115:MGTREFCLK1P_115) ; also sheet 14
TXN_0: SV2.8 U1.F1(B115:MGTXTXN0_115)
TXN_1: SV2.12 U1.D1(B115:MGTXTXN1_115)
TXN_2: SV2.16 U1.B1(B115:MGTXTXN2_115)
TXN_3: SV2.20 U1.A3(B115:MGTXTXN3_115)
TXP_0: SV2.7 U1.F2(B115:MGTXTXP0_115)
TXP_1: SV2.11 U1.D2(B115:MGTXTXP1_115)
TXP_2: SV2.15 U1.B2(B115:MGTXTXP2_115)
TXP_3: SV2.19 U1.A4(B115:MGTXTXP3_115)
Unconnected: SV2.1 SV2.2 SV2.3 SV2.4 U1.D5(B115:MGTREFCLK0N_115) U1.D6(B115:MGTREFCLK0P_115)

## Sheet 7 of 15: LEDs, Buttons
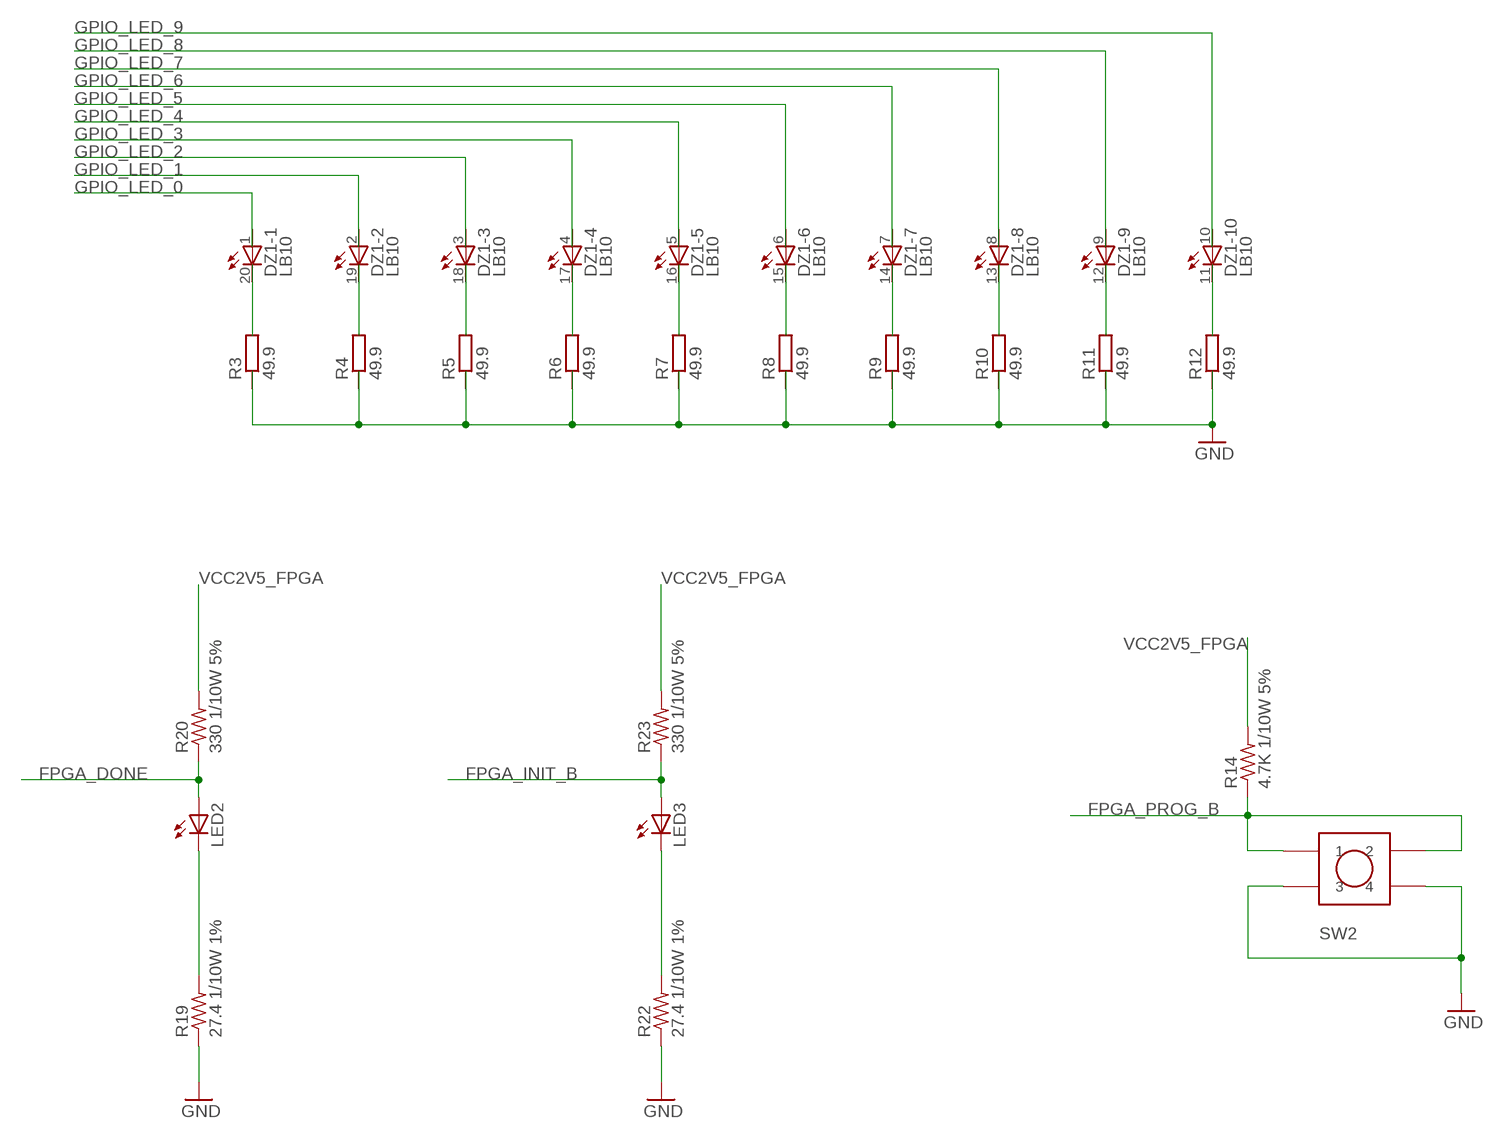
[diagram p6: schematic, sheet 7]

### Parts
DZ1  LB10  [LB10]
LED2  LEDSML0603  [SML0603]
LED3  LEDSML0603  [SML0603]
R3  49.9  R-EU_R0603  [R0603]
R4  49.9  R-EU_R0603  [R0603]
R5  49.9  R-EU_R0603  [R0603]
R6  49.9  R-EU_R0603  [R0603]
R7  49.9  R-EU_R0603  [R0603]
R8  49.9  R-EU_R0603  [R0603]
R9  49.9  R-EU_R0603  [R0603]
R10  49.9  R-EU_R0603  [R0603]
R11  49.9  R-EU_R0603  [R0603]
R12  49.9  R-EU_R0603  [R0603]
R14  4.7K 1/10W 5%  R-US_R0402  [R0402]
R19  27.4 1/10W 1%  R-US_R0402  [R0402]
R20  330 1/10W 5%  R-US_R0603  [R0603]
R22  27.4 1/10W 1%  R-US_R0402  [R0402]
R23  330 1/10W 5%  R-US_R0603  [R0603]
SW2  TL3301EF100QG"  [GULL-WING]

### Nets
FPGA_DONE: LED2.A R20.1 ; also sheet 2
FPGA_INIT_B: LED3.A R23.1 ; also sheet 2
FPGA_PROG_B: R14.1 SW2.P$1 SW2.P$2 ; also sheet 2
GND: R19.1 R22.1 SW2.P$3 SW2.P$4 ; also sheet 1,2,9,10,11,12,13,14,15
N$1: LED2.C R19.2
N$12: LED3.C R22.2
VCC2V5_FPGA: R14.2 R20.2 R23.2 ; also sheet 2,3,4,10,13,14
Unconnected: DZ1.1(-1:A) DZ1.2(-2:A) DZ1.3(-3:A) DZ1.4(-4:A) DZ1.5(-5:A) DZ1.6(-6:A) DZ1.7(-7:A) DZ1.8(-8:A) DZ1.9(-9:A) DZ1.10(-10:A) DZ1.11(-10:C) DZ1.12(-9:C) DZ1.13(-8:C) DZ1.14(-7:C) DZ1.15(-6:C) DZ1.16(-5:C) DZ1.17(-4:C) DZ1.18(-3:C) DZ1.19(-2:C) DZ1.20(-1:C) R3.1 R3.2 R4.1 R4.2 R5.1 R5.2 R6.1 R6.2 R7.1 R7.2 R8.1 R8.2 R9.1 R9.2 R10.1 R10.2 R11.1 R11.2 R12.1 R12.2

## Sheet 8 of 15: FPGA Power Pins
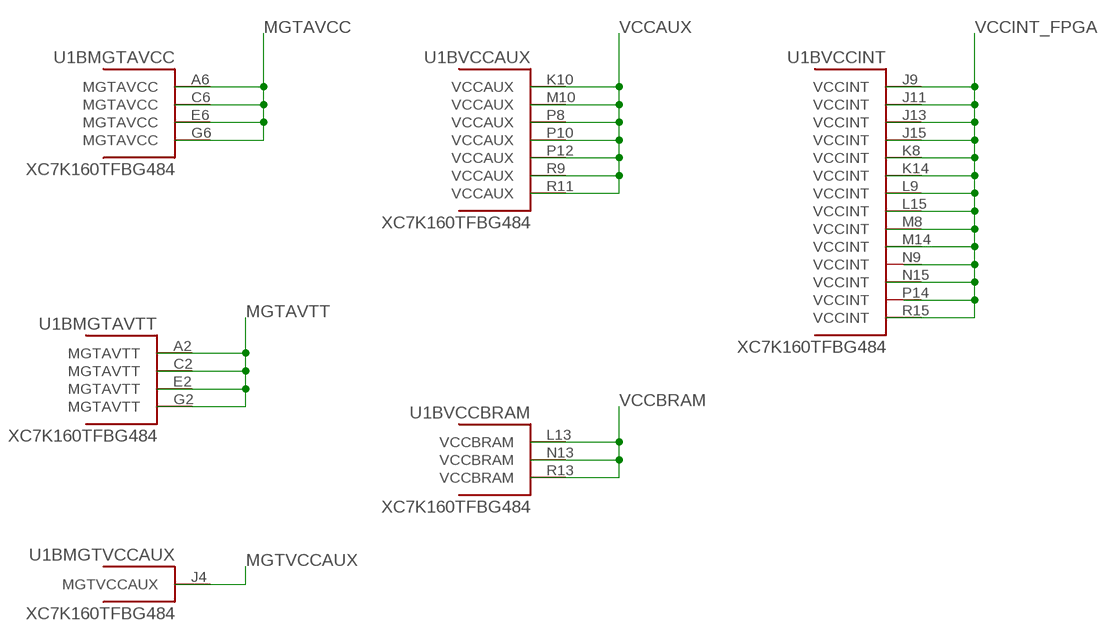
[diagram p7: schematic, sheet 8]
Unconnected: U1.A2(BMGTAVTT:MGTAVTT) U1.A6(BMGTAVCC:MGTAVCC) U1.C2(BMGTAVTT:MGTAVTT) U1.C6(BMGTAVCC:MGTAVCC) U1.E2(BMGTAVTT:MGTAVTT) U1.E6(BMGTAVCC:MGTAVCC) U1.G2(BMGTAVTT:MGTAVTT) U1.G6(BMGTAVCC:MGTAVCC) U1.J4(BMGTVCCAUX:MGTVCCAUX) U1.J9(BVCCINT:VCCINT) U1.J11(BVCCINT:VCCINT) U1.J13(BVCCINT:VCCINT) U1.J15(BVCCINT:VCCINT) U1.K8(BVCCINT:VCCINT) U1.K10(BVCCAUX:VCCAUX) U1.K14(BVCCINT:VCCINT) U1.L9(BVCCINT:VCCINT) U1.L13(BVCCBRAM:VCCBRAM) U1.L15(BVCCINT:VCCINT) U1.M8(BVCCINT:VCCINT) U1.M10(BVCCAUX:VCCAUX) U1.M14(BVCCINT:VCCINT) U1.N9(BVCCINT:VCCINT) U1.N13(BVCCBRAM:VCCBRAM) U1.N15(BVCCINT:VCCINT) U1.P8(BVCCAUX:VCCAUX) U1.P10(BVCCAUX:VCCAUX) U1.P12(BVCCAUX:VCCAUX) U1.P14(BVCCINT:VCCINT) U1.R9(BVCCAUX:VCCAUX) U1.R11(BVCCAUX:VCCAUX) U1.R13(BVCCBRAM:VCCBRAM) U1.R15(BVCCINT:VCCINT)

## Sheet 9 of 15: Ground planes
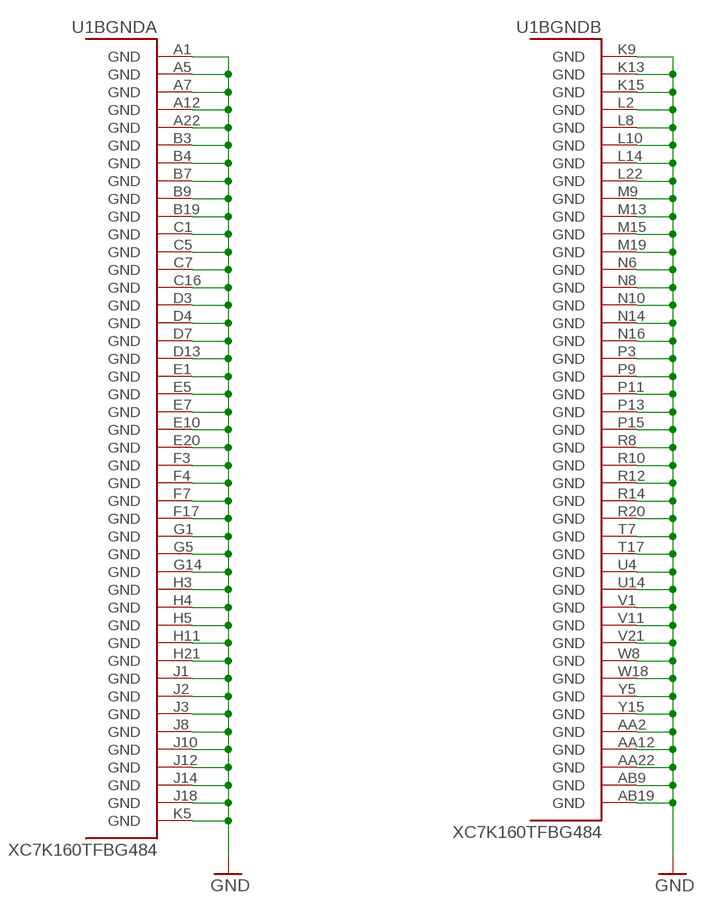
[diagram p8: schematic, sheet 9]

### Nets
GND: U1.A1(BGNDA:GND) U1.A5(BGNDA:GND) U1.A7(BGNDA:GND) U1.A12(BGNDA:GND) U1.A22(BGNDA:GND) U1.AA2(BGNDB:GND) U1.AA12(BGNDB:GND) U1.AA22(BGNDB:GND) U1.AB9(BGNDB:GND) U1.AB19(BGNDB:GND) U1.B3(BGNDA:GND) U1.B4(BGNDA:GND) U1.B7(BGNDA:GND) U1.B9(BGNDA:GND) U1.B19(BGNDA:GND) U1.C1(BGNDA:GND) U1.C5(BGNDA:GND) U1.C7(BGNDA:GND) U1.C16(BGNDA:GND) U1.D3(BGNDA:GND) U1.D4(BGNDA:GND) U1.D7(BGNDA:GND) U1.D13(BGNDA:GND) U1.E1(BGNDA:GND) U1.E5(BGNDA:GND) U1.E7(BGNDA:GND) U1.E10(BGNDA:GND) U1.E20(BGNDA:GND) U1.F3(BGNDA:GND) U1.F4(BGNDA:GND) U1.F7(BGNDA:GND) U1.F17(BGNDA:GND) U1.G1(BGNDA:GND) U1.G5(BGNDA:GND) U1.G14(BGNDA:GND) U1.H3(BGNDA:GND) U1.H4(BGNDA:GND) U1.H5(BGNDA:GND) U1.H11(BGNDA:GND) U1.H21(BGNDA:GND) U1.J1(BGNDA:GND) U1.J2(BGNDA:GND) U1.J3(BGNDA:GND) U1.J8(BGNDA:GND) U1.J10(BGNDA:GND) U1.J12(BGNDA:GND) U1.J14(BGNDA:GND) U1.J18(BGNDA:GND) U1.K5(BGNDA:GND) U1.K9(BGNDB:GND) U1.K13(BGNDB:GND) U1.K15(BGNDB:GND) U1.L2(BGNDB:GND) U1.L8(BGNDB:GND) U1.L10(BGNDB:GND) U1.L14(BGNDB:GND) U1.L22(BGNDB:GND) U1.M9(BGNDB:GND) U1.M13(BGNDB:GND) U1.M15(BGNDB:GND) U1.M19(BGNDB:GND) U1.N6(BGNDB:GND) U1.N8(BGNDB:GND) U1.N10(BGNDB:GND) U1.N14(BGNDB:GND) U1.N16(BGNDB:GND) U1.P3(BGNDB:GND) U1.P9(BGNDB:GND) U1.P11(BGNDB:GND) U1.P13(BGNDB:GND) U1.P15(BGNDB:GND) U1.R8(BGNDB:GND) U1.R10(BGNDB:GND) U1.R12(BGNDB:GND) U1.R14(BGNDB:GND) U1.R20(BGNDB:GND) U1.T7(BGNDB:GND) U1.T17(BGNDB:GND) U1.U4(BGNDB:GND) U1.U14(BGNDB:GND) U1.V1(BGNDB:GND) U1.V11(BGNDB:GND) U1.V21(BGNDB:GND) U1.W8(BGNDB:GND) U1.W18(BGNDB:GND) U1.Y5(BGNDB:GND) U1.Y15(BGNDB:GND) ; also sheet 1,2,7,10,11,12,13,14,15

## Sheet 10 of 15: FPGA Bypass Capacitors
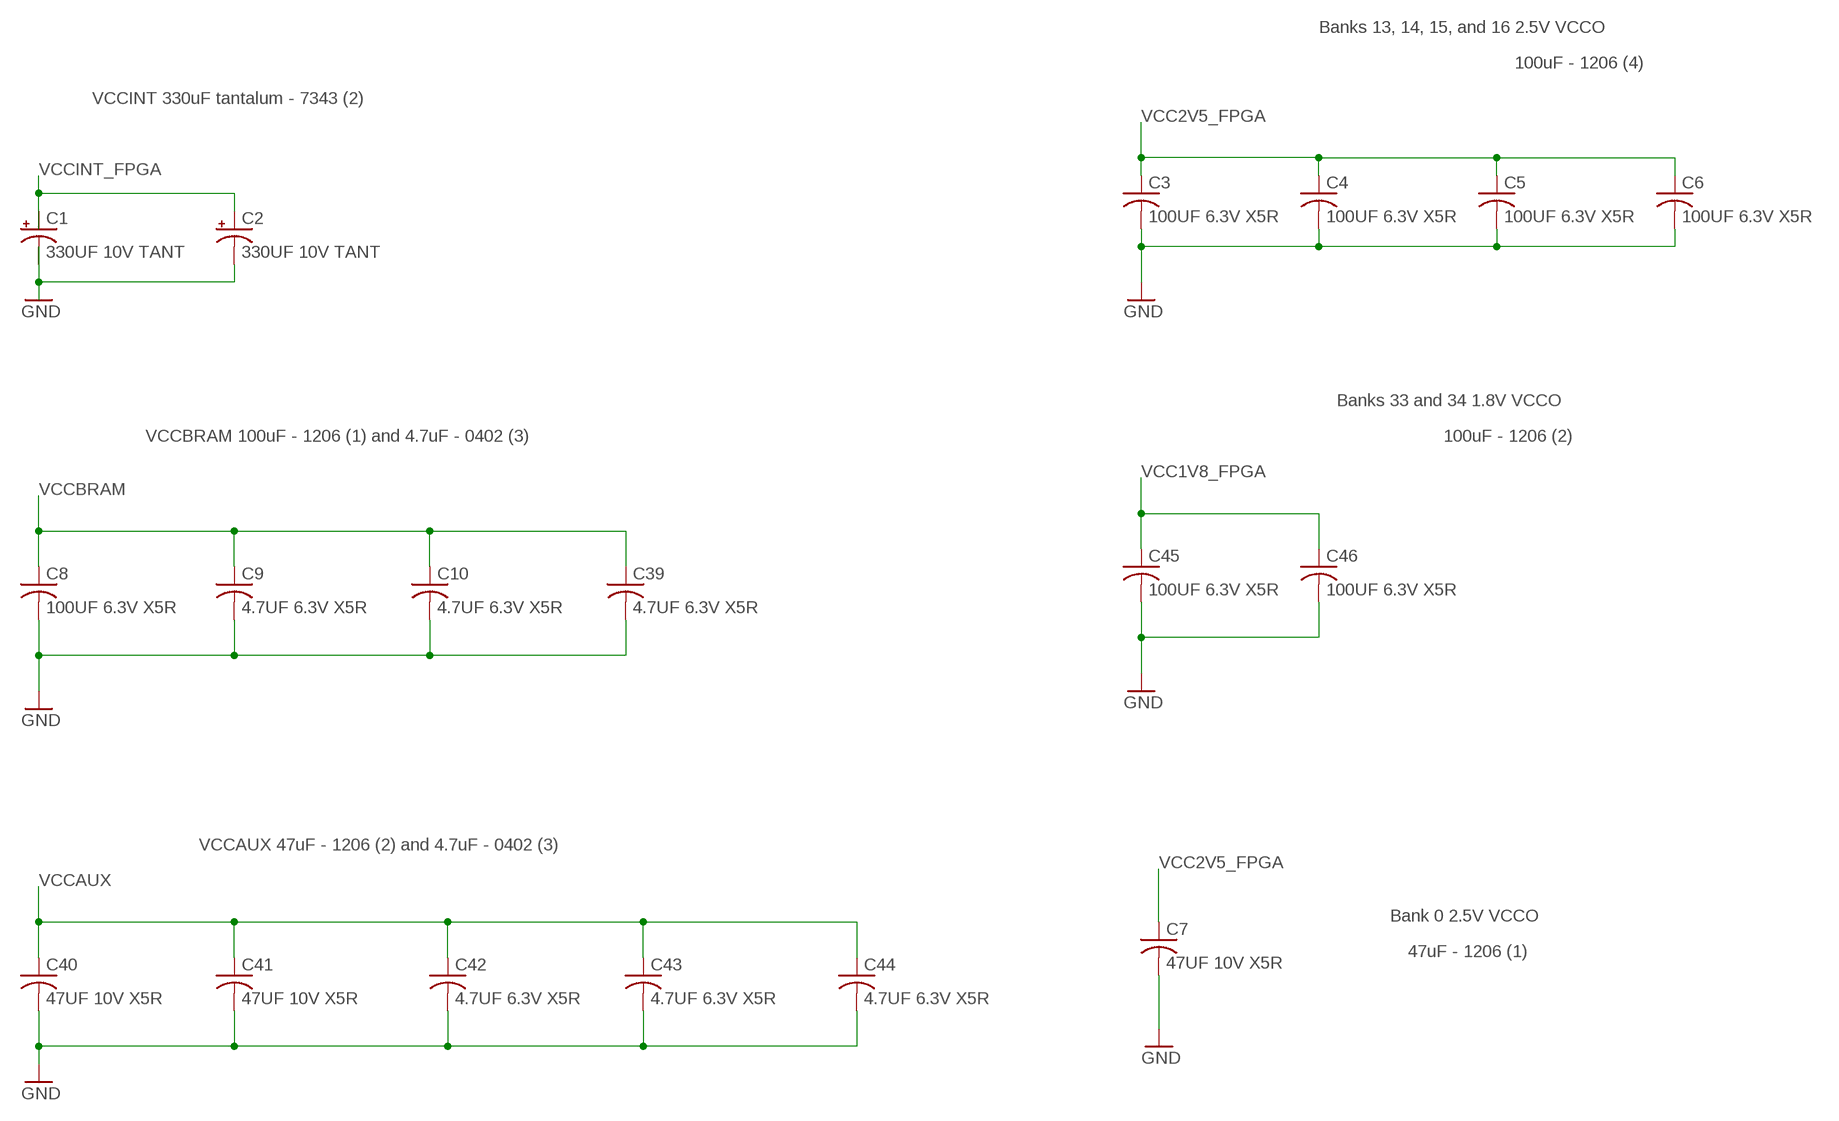
[diagram p9: schematic, sheet 10]

### Parts
C1  330UF 10V TANT  CPOL-USCT7343  [CT7343]
C2  330UF 10V TANT  CPOL-USCT7343  [CT7343]
C3  100UF 6.3V X5R  C-USC1206  [C1206]
C4  100UF 6.3V X5R  C-USC1206  [C1206]
C5  100UF 6.3V X5R  C-USC1206  [C1206]
C6  100UF 6.3V X5R  C-USC1206  [C1206]
C7  47UF 10V X5R  C-USC1206  [C1206]
C8  100UF 6.3V X5R  C-USC1206  [C1206]
C9  4.7UF 6.3V X5R  C-USC0402  [C0402]
C10  4.7UF 6.3V X5R  C-USC0402  [C0402]
C39  4.7UF 6.3V X5R  C-USC0402  [C0402]
C40  47UF 10V X5R  C-USC1206  [C1206]
C41  47UF 10V X5R  C-USC1206  [C1206]
C42  4.7UF 6.3V X5R  C-USC1206  [C1206]
C43  4.7UF 6.3V X5R  C-USC1206  [C1206]
C44  4.7UF 6.3V X5R  C-USC1206  [C1206]
C45  100UF 6.3V X5R  C-USC1206  [C1206]
C46  100UF 6.3V X5R  C-USC1206  [C1206]

### Nets
GND: C2.- C3.2 C4.2 C5.2 C6.2 C7.2 C8.2 C9.2 C10.2 C39.2 C40.2 C41.2 C42.2 C43.2 C44.2 C45.2 C46.2 ; also sheet 1,2,7,9,11,12,13,14,15
VCC1V8_FPGA: C45.1 C46.1 ; also sheet 5,13
VCC2V5_FPGA: C3.1 C4.1 C5.1 C6.1 C7.1 ; also sheet 2,3,4,7,13,14
VCCAUX: C40.1 C41.1 C42.1 C43.1 C44.1 ; also sheet 8
VCCBRAM: C8.1 C9.1 C10.1 C39.1 ; also sheet 8
VCCINT_FPGA: C2.+ ; also sheet 8
Unconnected: C1.+ C1.-

### Notes on the sheet
- Banks 13, 14, 15, and 16 2.5V VCCO
- 100uF - 1206 (4)
- VCCINT 330uF tantalum - 7343 (2)
- Banks 33 and 34 1.8V VCCO
- VCCBRAM 100uF - 1206 (1) and 4.7uF - 0402 (3) | 100uF - 1206 (2)
- VCCAUX 47uF - 1206 (2) and 4.7uF - 0402 (3)
- Bank 0 2.5V VCCO
- 47uF - 1206 (1)

## Sheet 11 of 15: FPGA MGT Bypass Capacitors
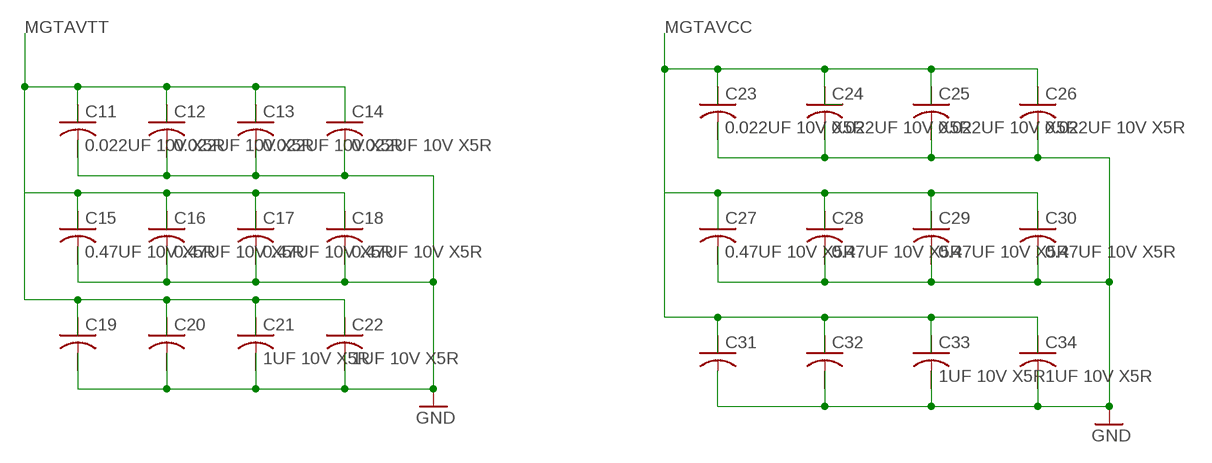
[diagram p10: schematic, sheet 11]

### Parts
C11  0.022UF 10V X5R  C-USC0603  [C0603]
C12  0.022UF 10V X5R  C-USC0603  [C0603]
C13  0.022UF 10V X5R  C-USC0603  [C0603]
C14  0.022UF 10V X5R  C-USC0603  [C0603]
C15  0.47UF 10V X5R  C-USC0603  [C0603]
C16  0.47UF 10V X5R  C-USC0603  [C0603]
C17  0.47UF 10V X5R  C-USC0603  [C0603]
C18  0.47UF 10V X5R  C-USC0603  [C0603]
C19  C-US01005  [C01005]
C20  C-US01005  [C01005]
C21  1UF 10V X5R  C-USC0603  [C0603]
C22  1UF 10V X5R  C-USC0603  [C0603]
C23  0.022UF 10V X5R  C-USC0603  [C0603]
C24  0.022UF 10V X5R  C-USC0603  [C0603]
C25  0.022UF 10V X5R  C-USC0603  [C0603]
C26  0.022UF 10V X5R  C-USC0603  [C0603]
C27  0.47UF 10V X5R  C-USC0603  [C0603]
C28  0.47UF 10V X5R  C-USC0603  [C0603]
C29  0.47UF 10V X5R  C-USC0603  [C0603]
C30  0.47UF 10V X5R  C-USC0603  [C0603]
C31  C-US01005  [C01005]
C32  C-US01005  [C01005]
C33  1UF 10V X5R  C-USC0603  [C0603]
C34  1UF 10V X5R  C-USC0603  [C0603]
Unconnected: C11.1 C11.2 C12.1 C12.2 C13.1 C13.2 C14.1 C14.2 C15.1 C15.2 C16.1 C16.2 C17.1 C17.2 C18.1 C18.2 C19.1 C19.2 C20.1 C20.2 C21.1 C21.2 C22.1 C22.2 C23.1 C23.2 C24.1 C24.2 C25.1 C25.2 C26.1 C26.2 C27.1 C27.2 C28.1 C28.2 C29.1 C29.2 C30.1 C30.2 C31.1 C31.2 C32.1 C32.2 C33.1 C33.2 C34.1 C34.2

## Sheet 12 of 15: Power connector
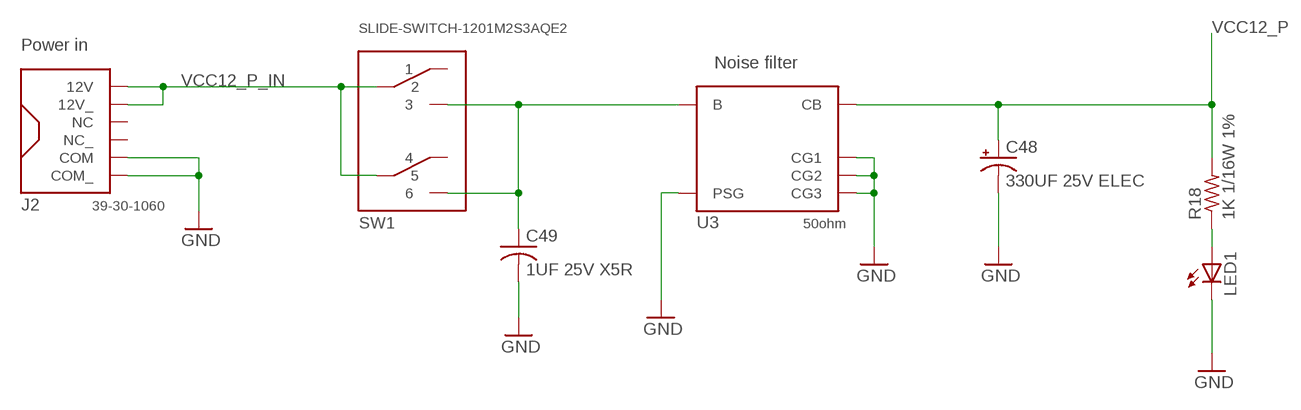
[diagram p11: schematic, sheet 12]

### Parts
C48  330UF 25V ELEC  CPOL-USF  [PANASONIC_F]
C49  1UF 25V X5R  C-USC0603  [C0603]
J2  39-30-1060  39-30-1060"  [5569_6P]
LED1  LEDSML0603  [SML0603]
R18  1K 1/16W 1%  R-US_R0402  [R0402]
SW1  SLIDE-SWITCH-1201M2S3AQE2  [HORIZONTAL-DPDT]
U3  50ohm  BNX016-01"  [BNX016-01]

### Nets
GND: C48.- C49.2 J2.P$3(COM) J2.P$6(COM_) LED1.C U3.CG$1(CG3) U3.CG$2(CG2) U3.P$3(PSG) U3.P$4(CG1) ; also sheet 1,2,7,9,10,11,13,14,15
N$13: LED1.A R18.1
VCC12_P: C48.+ R18.2 U3.P$2(CB) ; also sheet 13,15
VCC12_P_FILTER_IN: C49.1 SW1.3 SW1.6 U3.P$1(B)
VCC12_P_IN: J2.P$1(12V) J2.P$4(12V_) SW1.2 SW1.5
Unconnected: J2.P$2(NC) J2.P$5(NC_) SW1.1 SW1.4

### Notes on the sheet
- Power in
- Noise filter

## Sheet 13 of 15: Linear Power Supplies
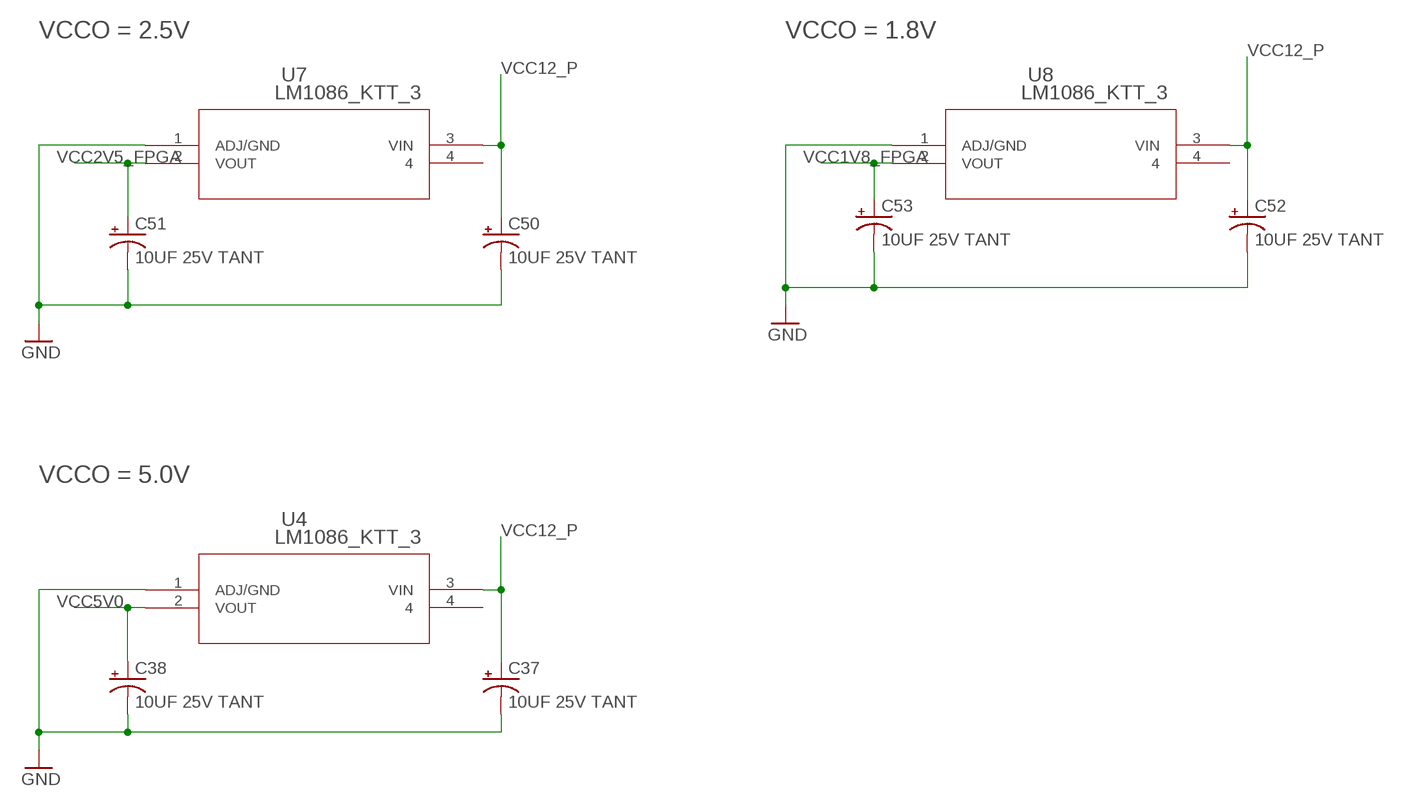
[diagram p12: schematic, sheet 13]

### Parts
C37  10UF 25V TANT  CPOL-USCT7343  [CT7343]
C38  10UF 25V TANT  CPOL-USCT7343  [CT7343]
C50  10UF 25V TANT  CPOL-USCT7343  [CT7343]
C51  10UF 25V TANT  CPOL-USCT7343  [CT7343]
C52  10UF 25V TANT  CPOL-USCT7343  [CT7343]
C53  10UF 25V TANT  CPOL-USCT7343  [CT7343]
U4  LM1086_KTT_3  [TS3B]
U7  LM1086_KTT_3  [TS3B]
U8  LM1086_KTT_3  [TS3B]

### Nets
GND: C37.- C38.- C50.- C51.- C52.- C53.- U4.1(ADJ/GND) U7.1(ADJ/GND) U8.1(ADJ/GND) ; also sheet 1,2,7,9,10,11,12,14,15
VCC1V8_FPGA: C53.+ U8.2(VOUT) ; also sheet 5,10
VCC2V5_FPGA: C51.+ U7.2(VOUT) ; also sheet 2,3,4,7,10,14
VCC5V0: C38.+ U4.2(VOUT) ; also sheet 15
VCC12_P: C37.+ C50.+ C52.+ U4.3(VIN) U7.3(VIN) U8.3(VIN) ; also sheet 12,15
Unconnected: U4.4 U7.4 U8.4

### Notes on the sheet
- VCCO = 2.5V | VCCO = 1.8V
- VCCO = 5.0V

## Sheet 14 of 15: Clock
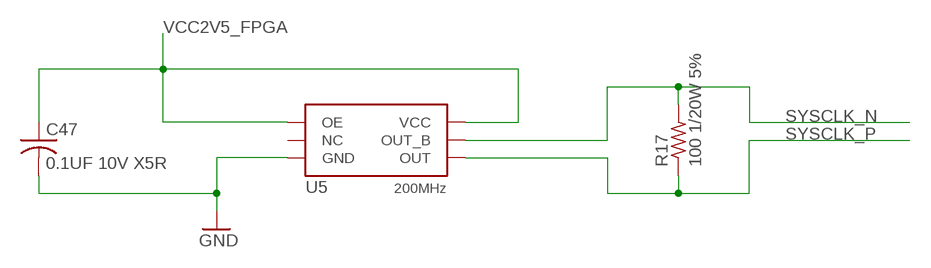
[diagram p13: schematic, sheet 14]

### Parts
C47  0.1UF 10V X5R  C-USC0402  [C0402]
R17  100 1/20W 5%  R-US_R0201  [R0201]
U5  200MHz  SIT9102"  [7X5]

### Nets
GND: C47.2 U5.P$3(GND) ; also sheet 1,2,7,9,10,11,12,13,15
SYSCLK_N: R17.2 U5.P$5(OUT_B) ; also sheet 6
SYSCLK_P: R17.1 U5.P$4(OUT) ; also sheet 6
VCC2V5_FPGA: C47.1 U5.P$1(OE) U5.P$6(VCC) ; also sheet 2,3,4,7,10,13
Unconnected: U5.P$2(NC)

## Sheet 15 of 15: VCCINT Regulator
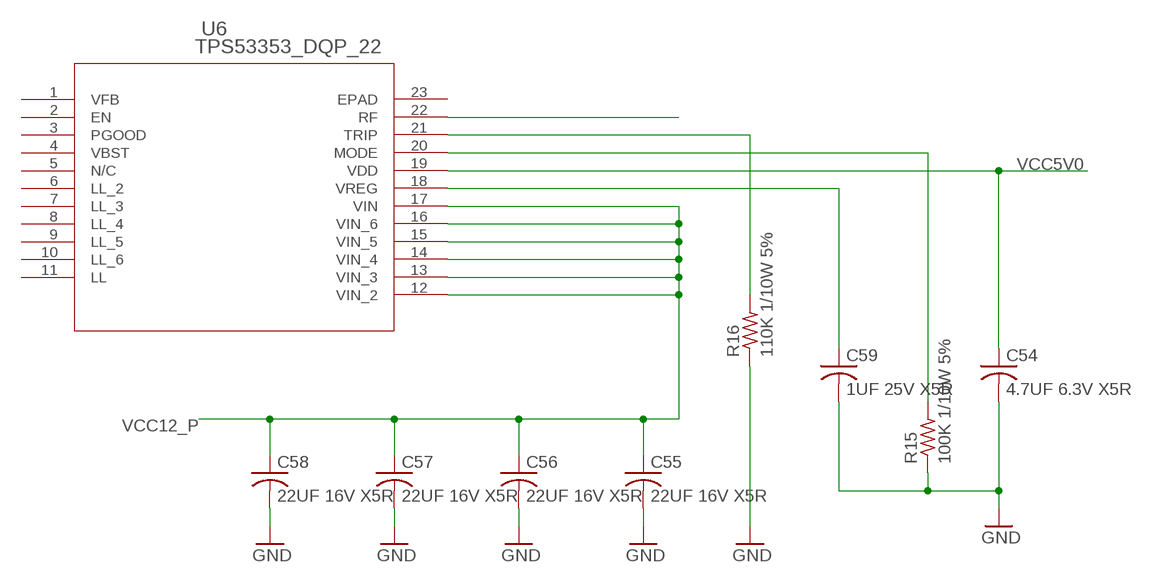
[diagram p14: schematic, sheet 15]

### Parts
C54  4.7UF 6.3V X5R  C-USC0402  [C0402]
C55  22UF 16V X5R  C-USC1206  [C1206]
C56  22UF 16V X5R  C-USC1206  [C1206]
C57  22UF 16V X5R  C-USC1206  [C1206]
C58  22UF 16V X5R  C-USC1206  [C1206]
C59  1UF 25V X5R  C-USC0603  [C0603]
R15  100K 1/10W 5%  R-US_R0402  [R0402]
R16  110K 1/10W 5%  R-US_R0402  [R0402]
U6  TPS53353_DQP_22  [DQP22_5P479X3P24]

### Nets
GND: C54.2 C55.2 C56.2 C57.2 C58.2 C59.2 R15.1 R16.1 ; also sheet 1,2,7,9,10,11,12,13,14
N$18: R15.2 U6.20(MODE)
RF: U6.22(RF)
TRIP: R16.2 U6.21(TRIP)
VCC5V0: C54.1 U6.19(VDD) ; also sheet 13
VCC12_P: C55.1 C56.1 C57.1 C58.1 U6.12(VIN_2) U6.13(VIN_3) U6.14(VIN_4) U6.15(VIN_5) U6.16(VIN_6) U6.17(VIN) ; also sheet 12,13
VREG: C59.1 U6.18(VREG)
Unconnected: U6.1(VFB) U6.2(EN) U6.3(PGOOD) U6.4(VBST) U6.5(N/C) U6.6(LL_2) U6.7(LL_3) U6.8(LL_4) U6.9(LL_5) U6.10(LL_6) U6.11(LL) U6.23(EPAD)

## Library data of the parts
C1 C2 C37 C38 C48 C50-C53 = rcl:CPOL-US: POLARIZED CAPACITOR, American symbol
C3-C34 C39-C47 C49 C54-C59 = rcl:C-US: CAPACITOR, American symbol
DZ1 = led:LB10: LED BLOCK 10-LED bar graph, DIL, Siemens
J2 = molex-con-39301060:39-30-1060: Molex Connector 39-30-1060 - Power Connector Technical Specifications: Vmax: 600V Imax: 13A Operating Temperature: -40°C to 105°C Termination style: through-hole To be used with power supply MENB1080A1251F01 Digikey: WM1353-ND Mouser: 538-39-30-1060
LED1-LED3 = led:LED: LED OSRAM: - CHIPLED LG R971, LG N971, LY N971, LG Q971, LY Q971, LO R971, LY R971 LH N974, LH R974 LS Q976, LO Q976, LY Q976 LO Q996 - Hyper CHIPLED LW Q18S LB Q993, LB Q99A, LB R99A - SideLED LS A670, LO A670, LY A670, LG A670, LP A670 LB A673, LV A673, LT A673, LW A673 LH A674 LY A675 LS A676, LA A676, LO A676, LY A676, LW A676 LS A679, LY A679, LG A679 - Hyper Micro SIDELED® LS Y876, LA Y876, LO Y876, LY Y876 LT Y87S - SmartLED LW L88C, LW L88S LB L89C, LB L89S, LG L890 LS L89K, LO L89K, LY L89K LS L896, LA L896, LO L896, LY L896 - TOPLED LS T670, LO T670, LY T670, LG T670, LP T670 LSG T670, LSP T670, LSY T670, LOP T670, LYG T670 LG T671, LOG T671, LSG T671 LB T673, LV T673, LT T673, LW T673 LH T674 LS T676, LA T676, LO T676, LY T676, LB T676, LH T676, LSB T676, LW T676 LB T67C, LV T67C, LT T67C, LS T67K, LO T67K, LY T67K, LW E67C LS E67B, LA E67B, LO E67B, LY E67B, LB E67C, LV E67C, LT E67C LW T67C LS T679, LY T679, LG T679 LS T770, LO T770, LY T770, LG T770, LP T770 LB T773, LV T773, LT T773, LW T773 LH T774 LS E675, LA E675, LY E675, LS T675 LS T776, LA T776, LO T776, LY T776, LB T776 LHGB T686 LT T68C, LB T68C - Hyper Mini TOPLED® LB M676 - Mini TOPLED Santana® LG M470 LS M47K, LO M47K, LY M47K Source: http://www.osram.convergy.de LUXEON: - LUMILED® LXK2-PW12-R00, LXK2-PW12-S00, LXK2-PW14-U00, LXK2-PW14-V00 LXK2-PM12-R00, LXK2-PM12-S00, LXK2-PM14-U00 LXK2-PE12-Q00, LXK2-PE12-R00, LXK2-PE12-S00, LXK2-PE14-T00, LXK2-PE14-U00 LXK2-PB12-K00, LXK2-PB12-L00, LXK2-PB12-M00, LXK2-PB14-N00, LXK2-PB14-P00, LXK2-PB14-Q00 LXK2-PR12-L00, LXK2-PR12-M00, LXK2-PR14-Q00, LXK2-PR14-R00 LXK2-PD12-Q00, LXK2-PD12-R00, LXK2-PD12-S00 LXK2-PH12-R00, LXK2-PH12-S00 LXK2-PL12-P00, LXK2-PL12-Q00, LXK2-PL12-R00 Source: www.luxeon.com KINGBRIGHT: KA-3528ASYC Source: www.kingbright.com
R1 R2 = rcl:R-EU_: RESISTOR, European symbol
R3-R12 = resistor:R-EU_: RESISTOR, European symbol
R13 R14 R16 = resistor:R-US_: RESISTOR, American symbol
R15 R17-R23 = rcl:R-US_: RESISTOR, American symbol
SV1 = con-lstb:MA07-2: PIN HEADER; OC_FARNELL: unknown; OC_NEWARK: unknown
SV2 = con-lstb:MA20-1: PIN HEADER; OC_FARNELL: unknown; OC_NEWARK: unknown
SV3-SV19 SV21-SV30 = con-lstb:MA10-1: PIN HEADER; OC_FARNELL: unknown; OC_NEWARK: unknown
SV20 = con-lstb:MA05-1: PIN HEADER; OC_FARNELL: unknown; OC_NEWARK: unknown
SW1 = slide-switch-1201M2S3AQE2:SLIDE-SWITCH-1201M2S3AQE2: 1201M2S3AQE2 - Slide switch C&K Technologies
SW2 = pushbutton-tl3301:TL3301EF100QG: E-Switch TL3301 - Pushbutton Manufacturer Part #: TL3301EF100QG Digikey: TL3301EF100QG-ND Mouser: 612-TL3301EF
U1 = xilinx_devices_V6:XC7K160TFBG484: Xilinx FPGA: XC7K160TFBG484
U3 = lc-filter-bnx016:BNX016-01: Murata BNX016-01 - LC filter Technical Specifications: VCC: 25V Operating Temperature: -40°C to 125°C Digikey: 490-5055-ND Mouser: 81-BNX016-01
U4 U7 U8 = linear-regulator-lm1086:LM1086_KTT_3; BASE_PN: LM1086; COMP: TypeLDO; LIBRARY: ReferenceLM1086CS; PARTNUMBER: LM1086CS-25; PIN: Count3; SYMBOL: NameLM1086CS-25; TYPE: LM1086CS-2.5; VENDOR: NationalSemiconductor; VERSION: 1
U5 = sitime-9102:SIT9102: SiTime 9102 - LVDS Oscillator Part#: SIT9102AI-243N25E200.0000 Technical Specifications: VCC: 2.5V Operating Temperature: -40°C to 125°C Package: 7x5mm Frequency stability: +-50ppm Digikey: 1473-1303-ND Mouser: 788-9102AI243N25E200
U6 = sw-regulator-tps53353:TPS53353_DQP_22; DATASHEETURL: http://www.ti.com/lit/gpn/TPS53353; DESCRIPTION: High-Efficiency 20-A Synchronous Buck Converter in PowerStack Package; FAMILY_NAME: STEP-DOWN REGULATOR; GENERIC_PART_NUMBER: TPS53353; INDUSTRY_STD_PKG_TYPE: SON; MANUFACTURER: Texas Instruments; MANUFACTURER_PART_NUMBER: tps53353_dqp_22; PACKAGE_DESIGNATOR: DQP; PIN_COUNT: 22; VENDOR: Texas Instruments